# EAGLE design spi (EAGLE 9.5.2)
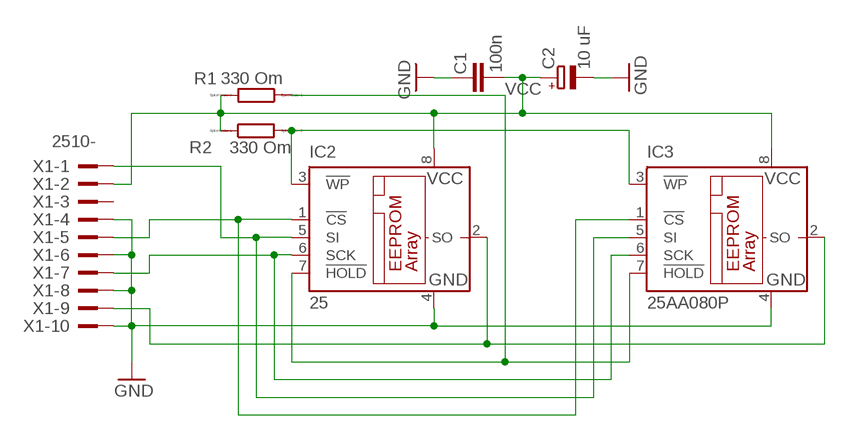
[diagram p0: schematic, sheet 1]

## Parts
C1  100n  C-EUC0805K  [C0805K]
C2  10 uF  CPOL-EUSMCD  [SMC_D]
IC2  25  [SO-08M]
IC3  25AA080P  [DIL8]
R1  330 Om  R0204/7  [0204/7]
R2  330 Om  R0204/7  [0204/7]
X1  2510-  [PAK100/2500-10]

## Nets
CS: IC2.1(!CS) IC3.1(!CS) X1.5
GND: C1.2 C2.- IC2.4(GND) IC3.4(GND) X1.4 X1.6 X1.8 X1.10
HOLD: IC2.7(!HOLD) IC3.7(!HOLD) R2.1
SCK: IC2.6(SCK) IC3.6(SCK) X1.7
SI: IC2.5(SI) IC3.5(SI) X1.1
SO: IC2.2(SO) IC3.2(SO) X1.9
VCC: C1.1 C2.+ IC2.8(VCC) IC3.8(VCC) R1.1 R2.2 X1.2
WP: IC2.3(!WP) IC3.3(!WP) R1.2
Unconnected: X1.3

## Library data of the parts
C1 = resistor:C-EU: CAPACITOR, European symbol
C2 = resistor:CPOL-EU: POLARIZED CAPACITOR, European symbol
IC2 = microchip:25
IC3 = microchip:25*: Serial EEPROM 4K/ 8K , SPI bus; MF: MICROCHIP; MPN: 25AA080/P; OC_FARNELL: 1331352; OC_NEWARK: 92C7349
R1 R2 = eagle-ltspice:R: RESISTOR, European symbol; SPICEMODEL: NONE; SPICEPREFIX: R
X1 = con-3m:2510-: 3M (TM) Pak 100 4-Wall Header Source: 3M; MF: 3M; MPN: 2510-6002UB; OC_FARNELL: 9838244; OC_NEWARK: 46F4725

## Board
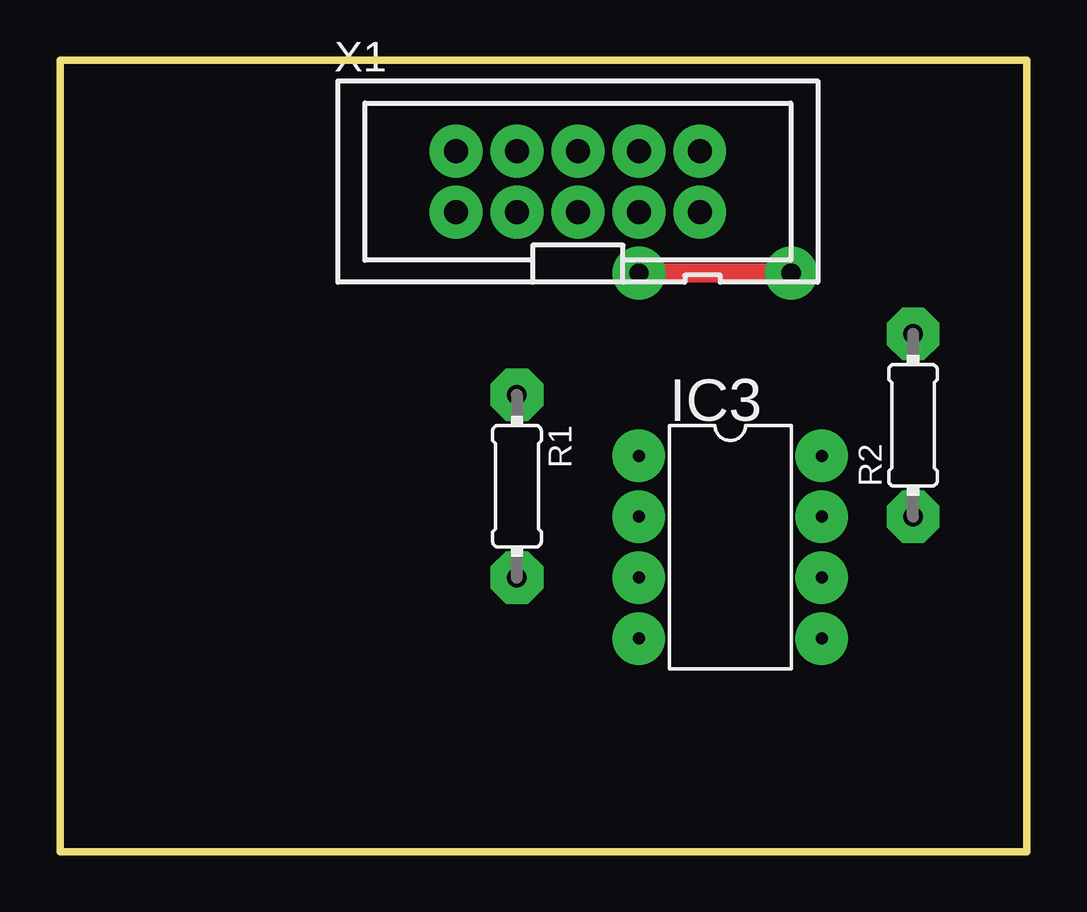
[diagram p1: board, top side]
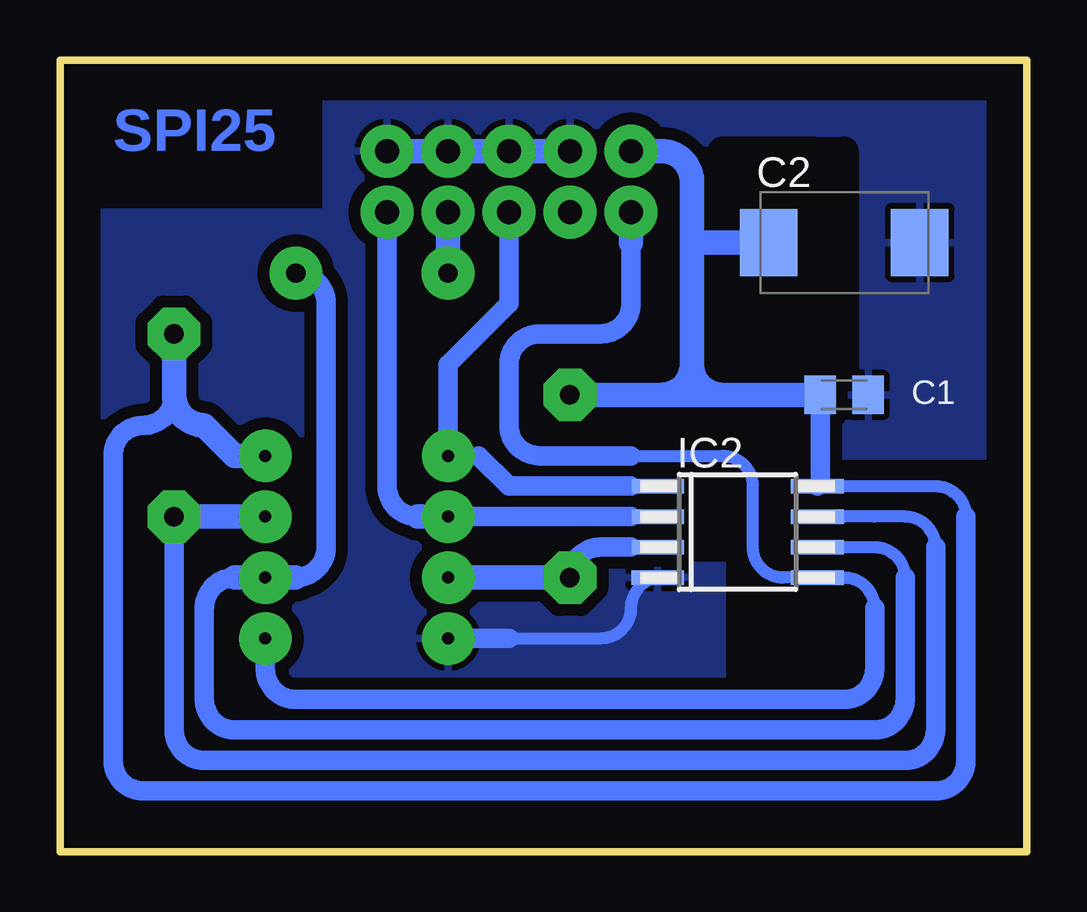
[diagram p2: board, bottom side, seen from below]

Size 40.31 x 33.01 mm. Coordinates in mm from the lower left corner, seen from the top.
Outline: 0,0 40.31,0 40.31,33.01 0,33.01 0,0
Copper layers (1*16): Top 0.035mm / dielectric 1.5mm / Bottom 0.035mm
Design rules "spi *": minimum track width 20mil, minimum drill 0.35mm, track to track 16mil, track to pad 10mil, pad to pad 0.205mm, via to via 0.205mm, smd to smd 8mil, copper to edge 60mil, drill to drill 60mil, minimum pad ring 0.6mm, minimum via ring 0.7mm, stop-mask expansion 4mil, vias tented up to drill 0mil, thermal gap 10mil
bRestrict: area 7.6,20.3 to 8.9,29.2; area 8.9,27.9 to 12.7,29.2; area 12.7,12.7 to 14,15.2

### Footprints (pad centres in the part's own frame; a part is rotated, then mirrored left to right if it is on the bottom)
C0805K = smd 1.3 x 1.6: 1 -1,0; 2 1,0
SMC_D = smd 2.4 x 2.8: + -3.15,0; - 3.15,0
SO-08M = smd 0.6 x 2.2: 1 -1.905,-3.33; 2 -0.635,-3.33; 3 0.635,-3.33; 4 1.905,-3.33; 5 1.905,3.33; 6 0.635,3.33; 7 -0.635,3.33; 8 -1.905,3.33
DIL8 = drill 0.5 pad 2.184: 1 -3.81,-3.81; 2 -1.27,-3.81; 3 1.27,-3.81; 4 3.81,-3.81; 5 3.81,3.81; 6 1.27,3.81; 7 -1.27,3.81; 8 -3.81,3.81
0204/7 = drill 0.813 pad 2.2 octagon: 1 -3.81,0; 2 3.81,0
PAK100/2500-10 = drill 1 pad 2.2: 1 -5.08,-1.27; 2 -5.08,1.27; 3 -2.54,-1.27; 4 -2.54,1.27; 5 0,-1.27; 6 0,1.27; 7 2.54,-1.27; 8 2.54,1.27; 9 5.08,-1.27; 10 5.08,1.27

### Placement (x,y rotation side)
C1  7.62,19.05 0 bottom
C2  7.62,25.4 0 bottom
IC2  12.06,13.33 270 bottom
IC3  27.94,12.7 270 top
R1  19.05,15.24 270 top
R2  35.56,17.78 90 top
X1  21.59,27.94 0 top

### Tracks (layer width: path | path; a pad name or v marks a point on that pad's centre or on a via)
CS
  Bottom 0.508: 22.86,16.51 IC3.1 | IC2.1 16.51,15.24
  Bottom 0.813: 22.86,16.51 21.59,15.24 16.51,15.24 | X1.5 21.59,22.86 24.13,20.32 IC3.1
GND
  Bottom 0.508: 15.24,11.43 arc-90 16.51,10.16 arc90 17.78,8.89 21.59,8.89
  Bottom 0.813: IC3.4 21.59,8.89
  Bottom 1.016: X1.4 X1.6 X1.8 X1.10
  pour Bottom (isolate 0.5): 0,33.02 0,16.51 12.7,16.51 12.7,0 39.37,0 39.37,26.67 29.21,26.67 29.21,33.02
HOLD
  Bottom 0.508: 3.81,12.7 arc-90 5.08,13.97 6.35,13.97 7.62,13.97 IC2.7
  Bottom 0.813: 3.81,12.7 3.81,5.08 arc90 5.08,3.81 34.29,3.81 arc90 35.56,5.08 R2.1
  Bottom 1.016: IC3.7 R2.1
SCK  (via drill 0.8)
  Top 0.813: v24.13,24.13 v30.48,24.13
  Bottom 0.508: IC2.6 6.35,12.7 arc90 5.08,11.43
  Bottom 0.813: 33.02,11.43 arc-90 34.29,10.16 34.29,6.35 arc-90 33.02,5.08 6.35,5.08 arc-90 5.08,6.35 5.08,11.43 | 30.48,11.43 arc-90 29.21,12.7 29.21,22.86 arc-90 v30.48,24.13
  Bottom 1.016: 33.02,11.43 IC3.6 30.48,11.43 | X1.7 v24.13,24.13
SI
  Bottom 0.508: 7.62,11.43 arc90 6.35,10.16 arc-90 7.62,11.43 | 16.51,16.51 12.7,16.51 arc90 11.43,15.24 11.43,12.7 arc-90 10.16,11.43 IC2.5 7.62,11.43
  Bottom 0.813: IC3.5 31.75,7.62 arc-90 30.48,6.35 7.62,6.35 arc-90 6.35,7.62 6.35,10.16 | 16.51,25.4 16.51,22.86 arc90 17.78,21.59 20.32,21.59 arc-90 21.59,20.32 21.59,17.78 arc-90 20.32,16.51 16.51,16.51
  Bottom 1.016: 16.51,25.4 X1.1
SO
  Bottom 0.508: 22.86,13.97 IC3.2 | IC2.2 17.78,13.97
  Bottom 0.813: 25.4,13.97 arc90 26.67,15.24 X1.9 | IC3.2 17.78,13.97 16.51,13.97
  Bottom 1.016: IC3.2 25.4,13.97
VCC
  Bottom 0.508: 2.54,13.97 arc-90 3.81,15.24 IC2.8
  Bottom 0.813: 2.54,13.97 2.54,3.81 arc90 3.81,2.54 36.83,2.54 arc90 38.1,3.81 38.1,16.51 arc90 36.83,17.78 arc-90 35.56,19.05 | C1.1 8.62,15.35 IC2.8
  Bottom 1.016: IC3.8 33.02,16.51 34.29,17.78 arc90 35.56,19.05 R2.2 | 13.97,20.32 13.97,25.4 | 13.97,25.4 13.97,27.94 arc-90 15.24,29.21 X1.2 | 13.97,25.4 C2.+ | R1.1 15.24,19.05 | 15.24,19.05 arc-90 13.97,20.32 | 13.97,20.32 arc-90 12.7,19.05 | 12.7,19.05 C1.1 arc-90 8.83,18.84 | 12.7,19.05 15.24,19.05
WP
  Bottom 0.508: R1.2 18.39,11.43 | IC2.3 16.51,12.7
  Bottom 0.813: R1.2 arc90 17.78,12.7 16.51,12.7
  Bottom 1.016: IC3.3 R1.2

### Text on the board
Bottom: SPI25